# Altium schematic sheet RAM_top.SchDoc
size 381 x 381 mm; SheetNumber: 1; SheetTotal: 2
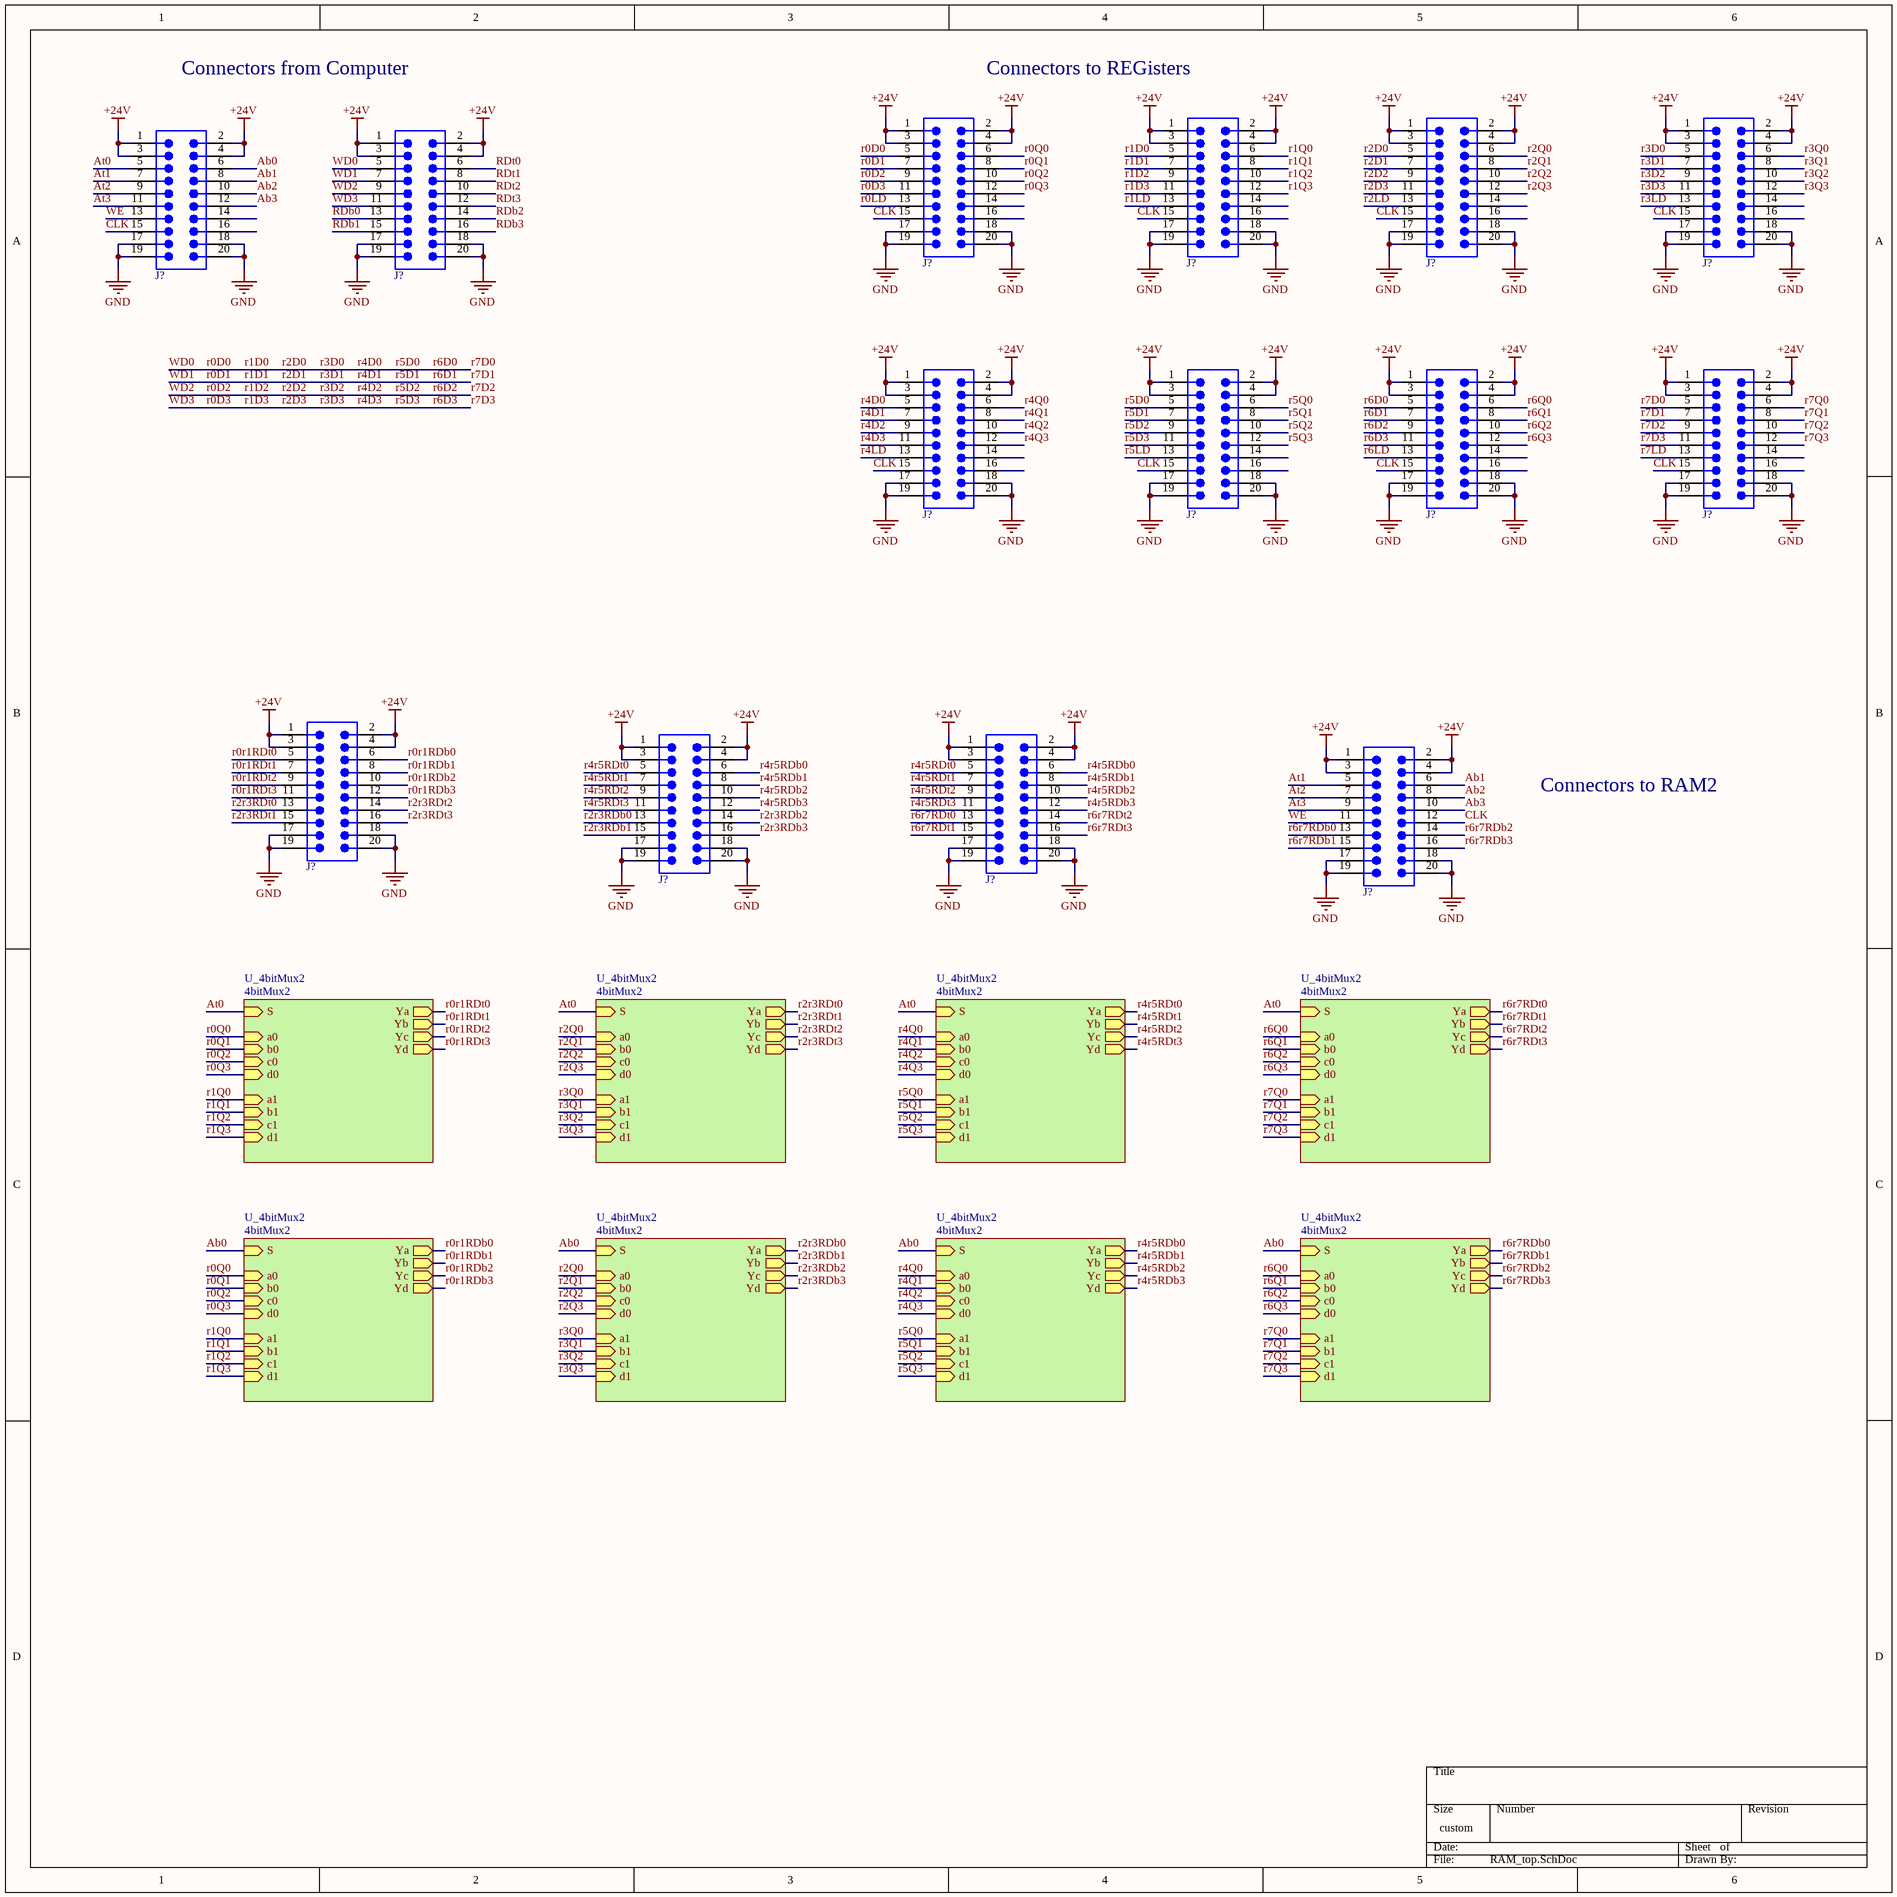
[diagram p0: RAM_top.SchDoc]

## Parts
(Parts that share a designator on the sheet are numbered #1, #2 ... from top to bottom, then left to right.)
J?#1  Con 2.54mm 10x2pos  [Con 2.54mm 10x2pos]  (value not drawn)
J?#2  Con 2.54mm 10x2pos  [Con 2.54mm 10x2pos]  (value not drawn)
J?#3  Con 2.54mm 10x2pos  [Con 2.54mm 10x2pos]  (value not drawn)
J?#4  Con 2.54mm 10x2pos  [Con 2.54mm 10x2pos]  (value not drawn)
J?#5  Con 2.54mm 10x2pos  [Con 2.54mm 10x2pos]  (value not drawn)
J?#6  Con 2.54mm 10x2pos  [Con 2.54mm 10x2pos]  (value not drawn)
J?#7  Con 2.54mm 10x2pos  [Con 2.54mm 10x2pos]  (value not drawn)
J?#8  Con 2.54mm 10x2pos  [Con 2.54mm 10x2pos]  (value not drawn)
J?#9  Con 2.54mm 10x2pos  [Con 2.54mm 10x2pos]  (value not drawn)
J?#10  Con 2.54mm 10x2pos  [Con 2.54mm 10x2pos]  (value not drawn)
J?#11  Con 2.54mm 10x2pos  [Con 2.54mm 10x2pos]  (value not drawn)
J?#12  Con 2.54mm 10x2pos  [Con 2.54mm 10x2pos]  (value not drawn)
J?#13  Con 2.54mm 10x2pos  [Con 2.54mm 10x2pos]  (value not drawn)
J?#14  Con 2.54mm 10x2pos  [Con 2.54mm 10x2pos]  (value not drawn)

## Sub-sheets
U_4bitMux2 = 4bitMux2: S (in), a0 (in), a1 (in), Ya (out), b0 (in), b1 (in), Yb (out), c0 (in), c1 (in), Yc (out), d0 (in), d1 (in), Yd (out)
U_4bitMux2 = 4bitMux2: S (in), a0 (in), a1 (in), Ya (out), b0 (in), b1 (in), Yb (out), c0 (in), c1 (in), Yc (out), d0 (in), d1 (in), Yd (out)
U_4bitMux2 = 4bitMux2: S (in), a0 (in), a1 (in), Ya (out), b0 (in), b1 (in), Yb (out), c0 (in), c1 (in), Yc (out), d0 (in), d1 (in), Yd (out)
U_4bitMux2 = 4bitMux2: S (in), a0 (in), a1 (in), Ya (out), b0 (in), b1 (in), Yb (out), c0 (in), c1 (in), Yc (out), d0 (in), d1 (in), Yd (out)
U_4bitMux2 = 4bitMux2: S (in), a0 (in), a1 (in), Ya (out), b0 (in), b1 (in), Yb (out), c0 (in), c1 (in), Yc (out), d0 (in), d1 (in), Yd (out)
U_4bitMux2 = 4bitMux2: S (in), a0 (in), a1 (in), Ya (out), b0 (in), b1 (in), Yb (out), c0 (in), c1 (in), Yc (out), d0 (in), d1 (in), Yd (out)
U_4bitMux2 = 4bitMux2: S (in), a0 (in), a1 (in), Ya (out), b0 (in), b1 (in), Yb (out), c0 (in), c1 (in), Yc (out), d0 (in), d1 (in), Yd (out)
U_4bitMux2 = 4bitMux2: S (in), a0 (in), a1 (in), Ya (out), b0 (in), b1 (in), Yb (out), c0 (in), c1 (in), Yc (out), d0 (in), d1 (in), Yd (out)

## Nets
+24V: J?#1.1 J?#1.2 J?#1.3 J?#1.4 J?#2.1 J?#2.2 J?#2.3 J?#2.4 J?#3.1 J?#3.2 J?#3.3 J?#3.4 J?#4.1 J?#4.2 J?#4.3 J?#4.4 J?#5.1 J?#5.2 J?#5.3 J?#5.4 J?#6.1 J?#6.2 J?#6.3 J?#6.4 J?#7.1 J?#7.2 J?#7.3 J?#7.4 J?#8.1 J?#8.2 J?#8.3 J?#8.4 J?#9.1 J?#9.2 J?#9.3 J?#9.4 J?#10.1 J?#10.2 J?#10.3 J?#10.4 J?#11.1 J?#11.2 J?#11.3 J?#11.4 J?#12.1 J?#12.2 J?#12.3 J?#12.4 J?#13.1 J?#13.2 J?#13.3 J?#13.4 J?#14.1 J?#14.2 J?#14.3 J?#14.4
GND: J?#1.17 J?#1.18 J?#1.19 J?#1.20 J?#2.17 J?#2.18 J?#2.19 J?#2.20 J?#3.17 J?#3.18 J?#3.19 J?#3.20 J?#4.17 J?#4.18 J?#4.19 J?#4.20 J?#5.17 J?#5.18 J?#5.19 J?#5.20 J?#6.17 J?#6.18 J?#6.19 J?#6.20 J?#7.17 J?#7.18 J?#7.19 J?#7.20 J?#8.17 J?#8.18 J?#8.19 J?#8.20 J?#9.17 J?#9.18 J?#9.19 J?#9.20 J?#10.17 J?#10.18 J?#10.19 J?#10.20 J?#11.17 J?#11.18 J?#11.19 J?#11.20 J?#12.17 J?#12.18 J?#12.19 J?#12.20 J?#13.17 J?#13.18 J?#13.19 J?#13.20 J?#14.17 J?#14.18 J?#14.19 J?#14.20
Ab0: J?#5.6 ; sheet U_4bitMux2/S, sheet U_4bitMux2/S, sheet U_4bitMux2/S, sheet U_4bitMux2/S
Ab1: J?#5.8 J?#14.6
Ab2: J?#5.10 J?#14.8
Ab3: J?#5.12 J?#14.10
At0: J?#5.5 ; sheet U_4bitMux2/S, sheet U_4bitMux2/S, sheet U_4bitMux2/S, sheet U_4bitMux2/S
At1: J?#5.7 J?#14.5
At2: J?#5.9 J?#14.7
At3: J?#5.11 J?#14.9
CLK: J?#1.15 J?#2.15 J?#3.15 J?#4.15 J?#5.15 J?#7.15 J?#8.15 J?#9.15 J?#10.15 J?#14.12
r0D0: J?#1.5 J?#2.5 J?#3.5 J?#4.5 J?#6.5 J?#7.5 J?#8.5 J?#9.5 J?#10.5  [also labelled r1D0, r2D0, r3D0, r4D0, r5D0, r6D0, r7D0, WD0]
r0D1: J?#1.7 J?#2.7 J?#3.7 J?#4.7 J?#6.7 J?#7.7 J?#8.7 J?#9.7 J?#10.7  [also labelled r1D1, r2D1, r3D1, r4D1, r5D1, r6D1, r7D1, WD1]
r0D2: J?#1.9 J?#2.9 J?#3.9 J?#4.9 J?#6.9 J?#7.9 J?#8.9 J?#9.9 J?#10.9  [also labelled r1D2, r2D2, r3D2, r4D2, r5D2, r6D2, r7D2, WD2]
r0D3: J?#1.11 J?#2.11 J?#3.11 J?#4.11 J?#6.11 J?#7.11 J?#8.11 J?#9.11 J?#10.11  [also labelled r1D3, r2D3, r3D3, r4D3, r5D3, r6D3, r7D3, WD3]
r0LD: J?#1.13
r0Q0: J?#1.6 ; sheet U_4bitMux2/a0, sheet U_4bitMux2/a0
r0Q1: J?#1.8 ; sheet U_4bitMux2/b0, sheet U_4bitMux2/b0
r0Q2: J?#1.10 ; sheet U_4bitMux2/c0, sheet U_4bitMux2/c0
r0Q3: J?#1.12 ; sheet U_4bitMux2/d0, sheet U_4bitMux2/d0
r0r1RDb0: J?#11.6 ; sheet U_4bitMux2/Ya
r0r1RDb1: J?#11.8 ; sheet U_4bitMux2/Yb
r0r1RDb2: J?#11.10 ; sheet U_4bitMux2/Yc
r0r1RDb3: J?#11.12 ; sheet U_4bitMux2/Yd
r0r1RDt0: J?#11.5 ; sheet U_4bitMux2/Ya
r0r1RDt1: J?#11.7 ; sheet U_4bitMux2/Yb
r0r1RDt2: J?#11.9 ; sheet U_4bitMux2/Yc
r0r1RDt3: J?#11.11 ; sheet U_4bitMux2/Yd
r1LD: J?#2.13
r1Q0: J?#2.6 ; sheet U_4bitMux2/a1, sheet U_4bitMux2/a1
r1Q1: J?#2.8 ; sheet U_4bitMux2/b1, sheet U_4bitMux2/b1
r1Q2: J?#2.10 ; sheet U_4bitMux2/c1, sheet U_4bitMux2/c1
r1Q3: J?#2.12 ; sheet U_4bitMux2/d1, sheet U_4bitMux2/d1
r2LD: J?#3.13
r2Q0: J?#3.6 ; sheet U_4bitMux2/a0, sheet U_4bitMux2/a0
r2Q1: J?#3.8 ; sheet U_4bitMux2/b0, sheet U_4bitMux2/b0
r2Q2: J?#3.10 ; sheet U_4bitMux2/c0, sheet U_4bitMux2/c0
r2Q3: J?#3.12 ; sheet U_4bitMux2/d0, sheet U_4bitMux2/d0
r2r3RDb0: J?#12.13 ; sheet U_4bitMux2/Ya
r2r3RDb1: J?#12.15 ; sheet U_4bitMux2/Yb
r2r3RDb2: J?#12.14 ; sheet U_4bitMux2/Yc
r2r3RDb3: J?#12.16 ; sheet U_4bitMux2/Yd
r2r3RDt0: J?#11.13 ; sheet U_4bitMux2/Ya
r2r3RDt1: J?#11.15 ; sheet U_4bitMux2/Yb
r2r3RDt2: J?#11.14 ; sheet U_4bitMux2/Yc
r2r3RDt3: J?#11.16 ; sheet U_4bitMux2/Yd
r3LD: J?#4.13
r3Q0: J?#4.6 ; sheet U_4bitMux2/a1, sheet U_4bitMux2/a1
r3Q1: J?#4.8 ; sheet U_4bitMux2/b1, sheet U_4bitMux2/b1
r3Q2: J?#4.10 ; sheet U_4bitMux2/c1, sheet U_4bitMux2/c1
r3Q3: J?#4.12 ; sheet U_4bitMux2/d1, sheet U_4bitMux2/d1
r4LD: J?#7.13
r4Q0: J?#7.6 ; sheet U_4bitMux2/a0, sheet U_4bitMux2/a0
r4Q1: J?#7.8 ; sheet U_4bitMux2/b0, sheet U_4bitMux2/b0
r4Q2: J?#7.10 ; sheet U_4bitMux2/c0, sheet U_4bitMux2/c0
r4Q3: J?#7.12 ; sheet U_4bitMux2/d0, sheet U_4bitMux2/d0
r4r5RDb0: J?#12.6 J?#13.6 ; sheet U_4bitMux2/Ya
r4r5RDb1: J?#12.8 J?#13.8 ; sheet U_4bitMux2/Yb
r4r5RDb2: J?#12.10 J?#13.10 ; sheet U_4bitMux2/Yc
r4r5RDb3: J?#12.12 J?#13.12 ; sheet U_4bitMux2/Yd
r4r5RDt0: J?#12.5 J?#13.5 ; sheet U_4bitMux2/Ya
r4r5RDt1: J?#12.7 J?#13.7 ; sheet U_4bitMux2/Yb
r4r5RDt2: J?#12.9 J?#13.9 ; sheet U_4bitMux2/Yc
r4r5RDt3: J?#12.11 J?#13.11 ; sheet U_4bitMux2/Yd
r5LD: J?#8.13
r5Q0: J?#8.6 ; sheet U_4bitMux2/a1, sheet U_4bitMux2/a1
r5Q1: J?#8.8 ; sheet U_4bitMux2/b1, sheet U_4bitMux2/b1
r5Q2: J?#8.10 ; sheet U_4bitMux2/c1, sheet U_4bitMux2/c1
r5Q3: J?#8.12 ; sheet U_4bitMux2/d1, sheet U_4bitMux2/d1
r6LD: J?#9.13
r6Q0: J?#9.6 ; sheet U_4bitMux2/a0, sheet U_4bitMux2/a0
r6Q1: J?#9.8 ; sheet U_4bitMux2/b0, sheet U_4bitMux2/b0
r6Q2: J?#9.10 ; sheet U_4bitMux2/c0, sheet U_4bitMux2/c0
r6Q3: J?#9.12 ; sheet U_4bitMux2/d0, sheet U_4bitMux2/d0
r6r7RDb0: J?#14.13 ; sheet U_4bitMux2/Ya
r6r7RDb1: J?#14.15 ; sheet U_4bitMux2/Yb
r6r7RDb2: J?#14.14 ; sheet U_4bitMux2/Yc
r6r7RDb3: J?#14.16 ; sheet U_4bitMux2/Yd
r6r7RDt0: J?#13.13 ; sheet U_4bitMux2/Ya
r6r7RDt1: J?#13.15 ; sheet U_4bitMux2/Yb
r6r7RDt2: J?#13.14 ; sheet U_4bitMux2/Yc
r6r7RDt3: J?#13.16 ; sheet U_4bitMux2/Yd
r7LD: J?#10.13
r7Q0: J?#10.6 ; sheet U_4bitMux2/a1, sheet U_4bitMux2/a1
r7Q1: J?#10.8 ; sheet U_4bitMux2/b1, sheet U_4bitMux2/b1
r7Q2: J?#10.10 ; sheet U_4bitMux2/c1, sheet U_4bitMux2/c1
r7Q3: J?#10.12 ; sheet U_4bitMux2/d1, sheet U_4bitMux2/d1
RDb0: J?#6.13
RDb1: J?#6.15
RDb2: J?#6.14
RDb3: J?#6.16
RDt0: J?#6.6
RDt1: J?#6.8
RDt2: J?#6.10
RDt3: J?#6.12
WE: J?#5.13 J?#14.11

Not connected (* = marked no-connect by the designer): J?#1 14 16; J?#2 14 16; J?#3 14 16; J?#4 14 16; J?#5 14 16; J?#7 14 16; J?#8 14 16; J?#9 14 16; J?#10 14 16

## Notes on the sheet
- Connectors from Computer
- Connectors to REGisters
- Connectors to RAM2

## Library data of the parts
J?#1-J?#14 = Con 2.54mm 10x2pos: WR-BHD Straight Male, Box Header, Through Hole, 2 Rows, 20 Contacts, 2.54mm Pitch; Manufacturer: Wurth Elektronik; Manufacturer Part Number: 61202021621; Connector Type: Male Pin; Contact Resistance: 20mΩ; Current Rating: 3A; Insulation: Insulated; Insulation Resistance: 1GΩ; Number of Contacts: 20; Operating Supply Voltage: 250V; Supplier: DigiKey; Supplier Part Number: 732-2096-ND; RoHS: Compliant; Category: Headers and Wire Housings; Stock: 12933; Pricing: 1=0.86, 10=0.839, 50=0.7732, 160=0.69213, 320=0.64375 (USD); Color: Black; Contact Gender: Male; Contact Material: Gold; Contact Plating: Gold; Flammability Rating: UL94 V-0; Gender: Male; Height: 9.25mm; Housing Material: PBT; Insulation Material: PBT; Lead Pitch: 2.54mm; Length: 33.06mm; Max Operating Temperature: 105°C; Min Operating Temperature: -40°C; Mounting Technology: Through Hole; Pins: 20; Number of Positions: 20; Number of Rows: 2; Orientation: Vertical; Pitch: 2.54mm; Row Spacing: 2.54mm; Termination: Through Hole; Voltage Rating: 250V; Voltage Rating (DC): 250V; Width: 33.06mm; ComponentLink1URL: https://datasheet.octopart.com:443/61202021621-W%C3%BCrth-Elektronik-datasheet-111087935.pdf?src-supplier=Upverter; ComponentLink1Description: https://datasheet.octopart.com:443/61202021621-W%C3%BCrth-Elektronik-datasheet-111087935.pdf?src-supplier=Upverter; ComponentLink2URL: https://datasheet.octopart.com:443/61202021621-Wurth-Elektronik-datasheet-168480024.pdf?src-supplier=Wurth+Elektronik; ComponentLink2Description: https://datasheet.octopart.com:443/61202021621-Wurth-Elektronik-datasheet-168480024.pdf?src-supplier=Wurth+Elektronik; ComponentLink3URL: https://datasheet.octopart.com:443/61202021621-W%C3%BCrth-Elektronik-datasheet-149523954.pdf?src-supplier=Farnell; ComponentLink3Description: https://datasheet.octopart.com:443/61202021621-W%C3%BCrth-Elektronik-datasheet-149523954.pdf?src-supplier=Farnell; ComponentLink4URL: https://datasheet.octopart.com:443/61202021621-W%C3%BCrth-Elektronik-Midcom-datasheet-10469446.pdf?src-supplier=Farnell; ComponentLink4Description: https://datasheet.octopart.com:443/61202021621-W%C3%BCrth-Elektronik-Midcom-datasheet-10469446.pdf?src-supplier=Farnell; ComponentLink5URL: https://datasheet.octopart.com:443/61202021621-W%C3%BCrth-Elektronik-Midcom-datasheet-5367532.pdf?src-supplier=element14+APAC; ComponentLink5Description: https://datasheet.octopart.com:443/61202021621-W%C3%BCrth-Elektronik-Midcom-datasheet-5367532.pdf?src-supplier=element14+APAC